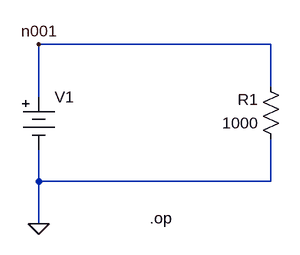
[diagram p0: schematic NV_SPICE_11.asc]
NV_SPICE_11.asc, the LTspice schematic file:
Version 4
SHEET 1 880 680
WIRE 432 48 80 48
WIRE 432 112 432 48
WIRE 80 128 80 48
WIRE 80 256 80 208
WIRE 432 256 432 192
WIRE 432 256 80 256
WIRE 80 320 80 256
FLAG 80 320 0
FLAG 80 48 n001
SYMBOL Misc\\battery 80 112 R0
WINDOW 3 24 104 Invisible 0
SYMATTR Value 9V
SYMATTR InstName V1
SYMATTR SpiceLine Rser=12.5
SYMBOL res 448 208 R180
WINDOW 0 36 76 Left 0
WINDOW 3 36 40 Left 0
SYMATTR InstName R1
SYMATTR Value 1000
TEXT 248 312 Left 0 !.op

The netlist it stands for:
* NV_SPICE_11.asc
V1 n001 0 9V Rser=12.5
R1 0 n001 1000
.op
.backanno
.end

* Results of the author's LTspice run, read from the files saved beside the schematic
* Operating Point:
*   V(n001) = 8.889 V
*   I(R1) = -8.889 mA
*   I(V1) = -8.889 mA